# Altium schematic sheet Power.SchDoc
size A4; Revision: C.2
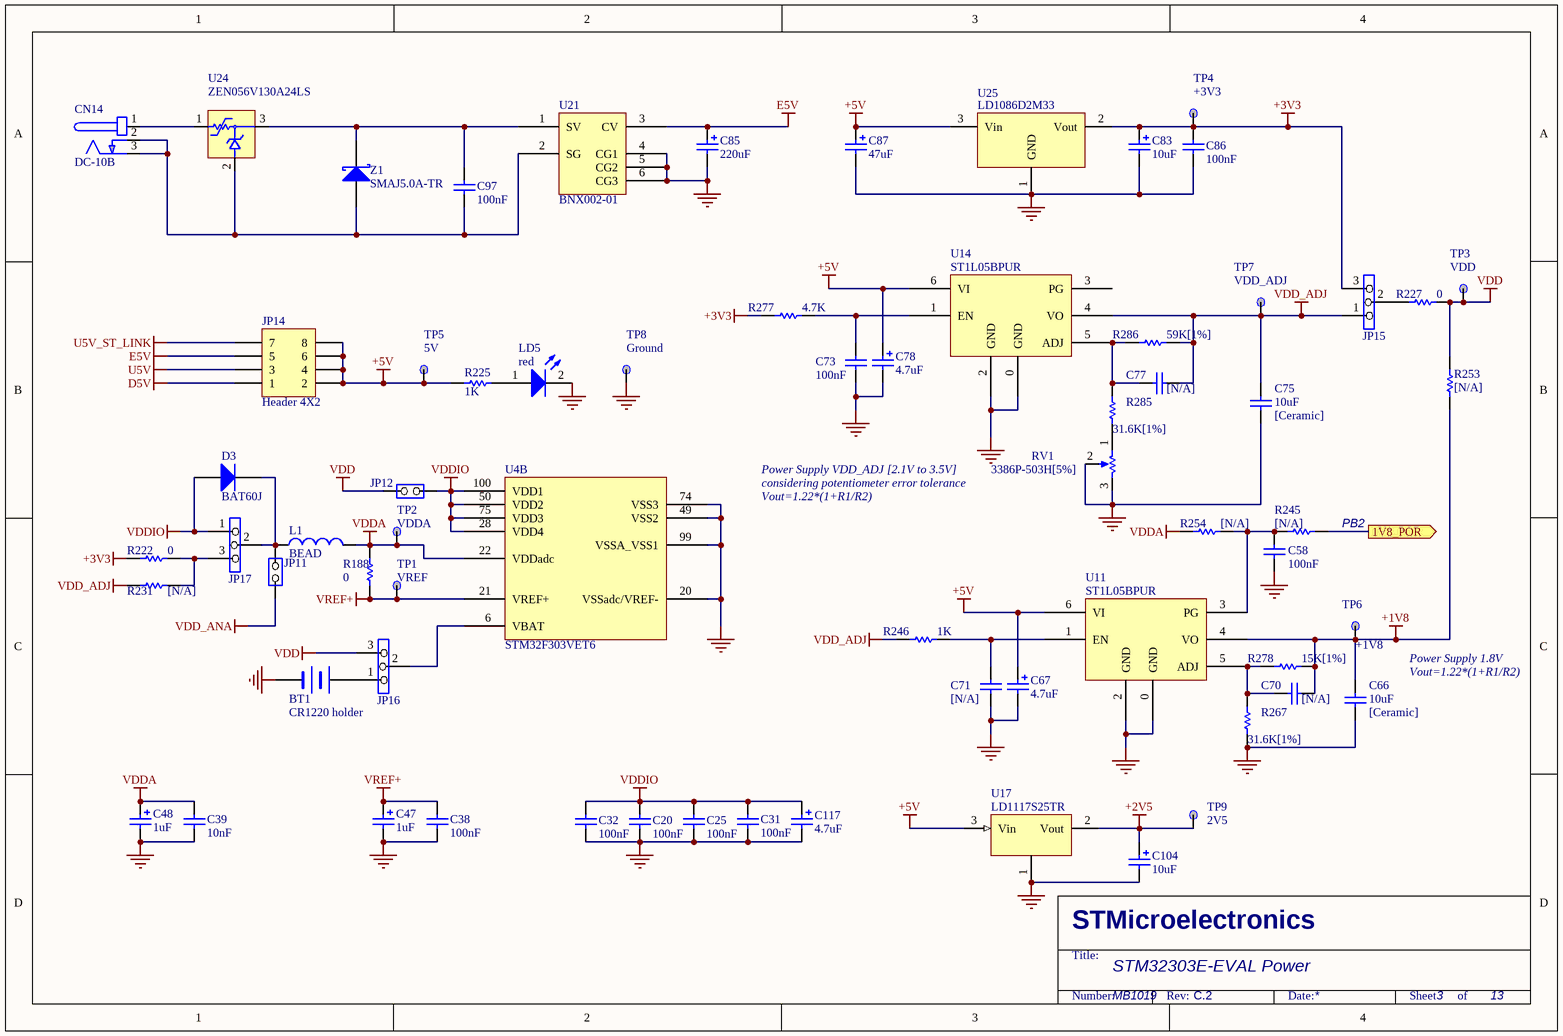
[diagram p0: Power.SchDoc]

## Parts
BT1  CR1220 holder  [LI1220_1]
C20  100nF  [0603C]
C25  100nF  [0603C]
C31  100nF  [0603C]
C32  100nF  [0603C]
C38  100nF  [0603C]
C39  10nF  [0603C]
C47  1uF  [TAN-A]
C48  1uF  [TAN-A]
C58  100nF  [0603C]
C66  10uF  [0805C]
C67  4.7uF  [TAN-A]
C70  [N/A]  [0603C]
C71  [N/A]  [0603C]
C73  100nF  [0603C]
C75  10uF  [0805C]
C77  [N/A]  [0603C]
C78  4.7uF  [TAN-A]
C83  10uF  [TAN-A]
C85  220uF  [C310M]
C86  100nF  [0603C]
C87  47uF  [C200M]
C97  100nF  [0603C]
C104  10uF  [TAN-A]
C117  4.7uF  [TAN-A]
CN14  DC-10B  [DC10B]
D3  BAT60J  [SOD-323]
JP11  (no value)  [SIP2]
JP12  (no value)  [SIP2]
JP14  Header 4X2  [2*4P]
JP15  (no value)  [SIP3]
JP16  (no value)  [SIP3]
JP17  (no value)  [SIP3]
L1  BEAD  [0603L]
LD5  red  [0603D]
R188  0  [0603R]
R222  0  [0603R]
R225  1K  [0603R]
R227  0  [0603R]
R231  [N/A]  [0603R]
R245  [N/A]  [0603R]
R246  1K  [0603R]
R253  [N/A]  [0603R]
R254  [N/A]  [0603R]
R267  31.6K[1%]  [0603R]
R277  4.7K  [0603R]
R278  15K[1%]  [0603R]
R285  31.6K[1%]  [0603R]
R286  59K[1%]  [0603R]
RV1  3386P-503H[5%]  [3296W]
TP1  VREF  [TP]
TP2  VDDA  [TP]
TP3  VDD  [TP]
TP4  +3V3  [TP]
TP5  5V  [TP]
TP6  +1V8  [TP]
TP7  VDD_ADJ  [TP]
TP8  Ground  [TP]
TP9  2V5  [TP]
U4  STM32F303VET6  [IC149-100-025-B5]  (part B of 2)
U11  ST1L05BPUR  [DFN6(3X3)]
U14  ST1L05BPUR  [DFN6(3X3)]
U17  LD1117S25TR  [SOT-223]
U21  BNX002-01  [BNX001]
U24  ZEN056V130A24LS  [polyzen]
U25  LD1086D2M33  [D2PAK/A]
Z1  SMAJ5.0A-TR  [1R1C]

## Ports
1V8_POR (out)

## Nets
+1V8: C66.1 C70.2 R253.2 R278.1 TP6.1 U11.4(VO)
+2V5: C104.1 TP9.1 U17.2(Vout)
+3V3: C83.1 C86.1 JP15.3 R222.2 R277.2 TP4.1 U25.2(Vout)
+5V: C67.1 C78.1 C87.1 JP14.2 JP14.4 JP14.6 JP14.8 R225.2 TP5.1 U11.6(VI) U14.6(VI) U17.3(Vin) U25.3(Vin)
D5V: JP14.1
E5V: C85.1 JP14.5 U21.3(CV)
GND: BT1.2(-) C20.2 C25.2 C31.1 C32.2 C38.1 C39.1 C47.2 C48.2 C58.2 C66.2 C67.2 C71.2 C73.2 C75.2 C78.2 C83.2 C85.2 C86.2 C87.2 C104.2 C117.2 LD5.2(K) R267.2 RV1.2(TAP) RV1.3(TOP) TP8.1 U4.20(VSSadc/VREF-) U4.49(VSS2) U4.74(VSS3) U4.99(VSSA_VSS1) U11.0(GND) U11.2(GND) U14.0(GND) U14.2(GND) U17.1 U21.4(CG1) U21.5(CG2) U21.6(CG3) U25.1(GND)
U5V: JP14.3
U5V_ST_LINK: JP14.7
VDD: JP12.2(NO) JP16.3 R227.1 R253.1 TP3.1
VDD_ADJ: C75.1 C77.2 JP15.1 R231.2 R246.2 R286.1 TP7.1 U14.4(VO)
VDD_ANA: JP11.1(COMMON)
VDDA: C39.2 C48.1 L1.2 R188.1 R254.1 TP2.1 U4.22(VDDadc)
VDDIO: C20.1 C25.1 C31.2 C32.1 C117.1 D3.1(A) JP12.1(COMMON) JP17.1 U4.28(VDD4) U4.50(VDD2) U4.75(VDD3) U4.100(VDD1)
VREF+: C38.2 C47.1 R188.2 TP1.1 U4.21(VREF+)
1V8_POR: R245.1 ; port 1V8_POR
NetBT1_1: BT1.1(+) JP16.1
NetC58_1: C58.1 R245.2 R254.2 U11.3(PG)
NetC70_1: C70.1 R267.1 R278.2 U11.5(ADJ)
NetC71_1: C71.1 R246.1 U11.1(EN)
NetC73_1: C73.1 R277.1 U14.1(EN)
NetC77_1: C77.1 R285.1 R286.2 U14.5(ADJ)
NetC97_1: C97.1 U21.1(SV) U24.3 Z1.2(K)
NetC97_2: C97.2 CN14.2(GND) CN14.3(GND) U21.2(SG) U24.2 Z1.1(A)
NetCN14_1: CN14.1(+) U24.1
NetD3_2: D3.2(K) JP11.2(NO) JP17.2 L1.1
NetJP15_2: JP15.2 R227.2
NetJP16_2: JP16.2 U4.6(VBAT)
NetJP17_3: JP17.3 R222.1 R231.1
NetLD5_1: LD5.1(A) R225.1
NetR285_2: R285.2 RV1.1(BOT)

Not connected (* = marked no-connect by the designer): U14 3(PG)

## Notes on the sheet
- (near C75) [Ceramic]
- Power Supply VDD_ADJ [2.1V to 3.5V]
- Vout=1.22*(1+R1/R2)
- considering potentiometer error tolerance
- (near R245) PB2
- (near C66) [Ceramic]
- Power Supply 1.8V
- STM32303E-EVAL Power
- MB1019
- 3
- 13
- STMicroelectronics
- Title:
- Number:
- Rev:
- Date:
- Sheet       of

## Library data of the parts
BT1 = BATTERY
C20 C25 C32 = CAP: Capacitor; Published: 8-Jun-2000; Revision: July-2002: Re-released for DXP Platform.; Publisher: Altium Limited; Value: 100nF
C31 C38 C58 C66 C70 C71 C73 C75 C77 C86 = Cap: Capacitor; Value: 10nF; Published: 8-Jun-2000; Revision: July-2002: Re-released for DXP Platform.; Publisher: Altium Limited
C39 = Cap: Capacitor; Published: 8-Jun-2000; Revision: July-2002: Re-released for DXP Platform.; Publisher: Altium Limited; Value: 10nF
C47 C48 C87 = Cap Pol1: Polarized Capacitor (Radial); Value: 10uF; Published: 8-Jun-2000; Revision: July-2002: Re-released for DXP Platform.; Publisher: Altium Limited
C67 C78 C117 = Cap Pol1: Polarized Capacitor (Radial); Value: 100pF; Published: 8-Jun-2000; Revision: July-2002: Re-released for DXP Platform.; Publisher: Altium Limited
C83 C104 = Cap Pol1: Polarized Capacitor (Radial); Published: 8-Jun-2000; Revision: July-2002: Re-released for DXP Platform.; Publisher: Altium Limited; Value: 10uF
C85 = Cap Pol1: Polarized Capacitor (Radial); Value: 47uF; Published: 8-Jun-2000; Revision: July-2002: Re-released for DXP Platform.; Publisher: Altium Limited
C97 = CAP: Capacitor; Value: 100pF; Published: 8-Jun-2000; Revision: July-2002: Re-released for DXP Platform.; Publisher: Altium Limited
CN14 = PJ202A
D3 = Diode: Default Diode; Code - JEDEC: DO-214-AB; Published: 8-Jun-2000; Revision: July-2002: Re-released for DXP Platform.; Publisher: Altium Limited
JP11 JP12 = JP2
JP14 = Header 4X2: Header, 4-Pin, Dual row; Revision: 17-Jul-2002: Re-released for DXP Platform.; Publisher: Altium Limited
JP15-JP17 = Jumper3
L1 = Inductor: Value: 100uH; Published: 8-Jun-2000; Revision: July-2002: Re-released for DXP Platform.; Publisher: Altium Limited
LD5 = LED2: Typical RED, GREEN, YELLOW, AMBER GaAs LED; Published: 8-Jun-2000; Revision: July-2002: Re-released for DXP Platform.; Publisher: Altium Limited
R188 R222 R227 R231 R245 R253 R267 R278 R285 R286 = Res1: Resistor; Value: 1K; Published: 8-Jun-2000; Revision: July-2002: Re-released for DXP Platform.; Publisher: Altium Limited
R225 R246 = res1: Resistor; Published: 8-Jun-2000; Revision: July-2002: Re-released for DXP Platform.; Publisher: Altium Limited; Value: 1K
R254 R277 = res1: Resistor; Value: 1K; Published: 8-Jun-2000; Revision: July-2002: Re-released for DXP Platform.; Publisher: Altium Limited
RV1 = RV
TP1-TP9 = TP
U4 = STM32F303VCT6
U11 U14 = ST1L05
U17 = LD1117
U21 = BNX002
U25 = VOLTREG1
Z1 = D Schottky: Schottky Diode; Code - JEDEC: DO-214-AA; Published: 8-Jun-2000; Revision: July-2002: Re-released for DXP Platform.; Publisher: Altium Limited